# EAGLE design CAN Interface (EAGLE 7.2.0)
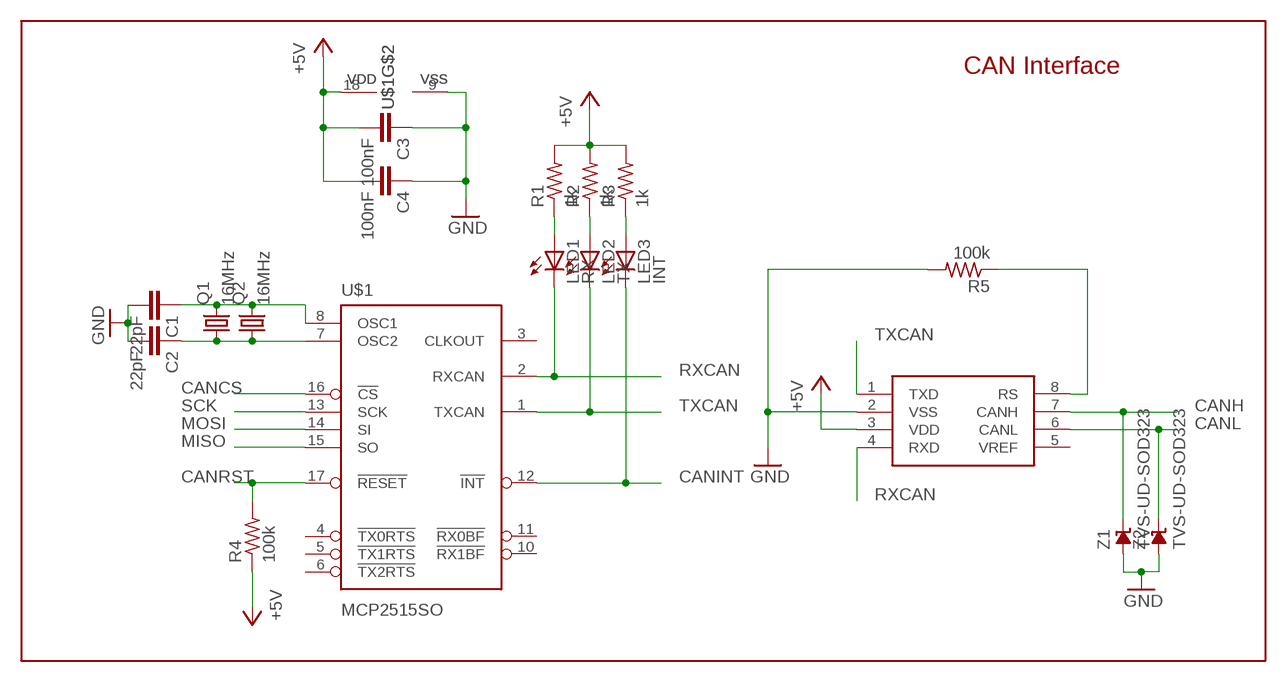
[diagram p0: schematic, sheet 1]

## Parts
C1  22pF  C-EUC0805K  [C0805K]
C2  22pF  C-EUC0805K  [C0805K]
C3  100nF  C-EUC0805K  [C0805K]
C4  100nF  C-EUC0805K  [C0805K]
LED1  RX  LEDCHIP-LED0805  [CHIP-LED0805]
LED2  TX  LEDCHIP-LED0805  [CHIP-LED0805]
LED3  INT  LEDCHIP-LED0805  [CHIP-LED0805]
Q1  16MHz  CRYSTALHC49S  [HC49/S]
Q2  16MHz  CRYSTALHC49UP  [HC49UP]
R1  1k  R-US_R0805  [R0805]
R2  1k  R-US_R0805  [R0805]
R3  1k  R-US_R0805  [R0805]
R4  100k  R-US_R0805  [R0805]
R5  100k  R-US_R0805  [R0805]
U1  MCP2551  [SO08]
U$1  MCP2515SO  [SO-18W]
Z1  TVS-UD-SOD323  [SOD323]
Z2  TVS-UD-SOD323  [SOD323]

## Nets
+5V: C3.2 C4.2 R1.2 R2.2 R3.2 R4.1 U1.3(VDD) U$1.18(VDD)
CANCS: U$1.16(!CS)
CANH: U1.7(CANH) Z1.C
CANINT: LED3.C U$1.12(!INT)
CANL: U1.6(CANL) Z2.C
CANRST: R4.2 U$1.17(!RESET)
CANSTBY: R5.1 U1.8(RS)
GND: C1.2 C2.2 C3.1 C4.1 R5.2 U1.2(VSS) U$1.9(VSS) Z1.A Z2.A
MISO: U$1.15(SO)
MOSI: U$1.14(SI)
N$1: C2.1 Q1.1 Q2.1 U$1.7(OSC2)
N$4: C1.1 Q1.2 Q2.2 U$1.8(OSC1)
N$7: LED1.A R1.1
N$8: LED2.A R2.1
N$9: LED3.A R3.1
RXCAN: LED1.C U1.4(RXD) U$1.2(RXCAN)
SCK: U$1.13(SCK)
TXCAN: LED2.C U1.1(TXD) U$1.1(TXCAN)
Unconnected: U1.5(VREF) U$1.3(CLKOUT) U$1.4(!TX0RTS) U$1.5(!TX1RTS) U$1.6(!TX2RTS) U$1.10(!RX1BF) U$1.11(!RX0BF)

## Notes on the sheet
- CAN Interface

## Library data of the parts
C1-C4 = resistor:C-EU: CAPACITOR, European symbol
LED1-LED3 = led:LED: LED OSRAM: - CHIPLED LG R971, LG N971, LY N971, LG Q971, LY Q971, LO R971, LY R971 LH N974, LH R974 LS Q976, LO Q976, LY Q976 LO Q996 - Hyper CHIPLED LW Q18S LB Q993, LB Q99A, LB R99A - SideLED LS A670, LO A670, LY A670, LG A670, LP A670 LB A673, LV A673, LT A673, LW A673 LH A674 LY A675 LS A676, LA A676, LO A676, LY A676, LW A676 LS A679, LY A679, LG A679 - Hyper Micro SIDELED® LS Y876, LA Y876, LO Y876, LY Y876 LT Y87S - SmartLED LW L88C, LW L88S LB L89C, LB L89S, LG L890 LS L89K, LO L89K, LY L89K LS L896, LA L896, LO L896, LY L896 - TOPLED LS T670, LO T670, LY T670, LG T670, LP T670 LSG T670, LSP T670, LSY T670, LOP T670, LYG T670 LG T671, LOG T671, LSG T671 LB T673, LV T673, LT T673, LW T673 LH T674 LS T676, LA T676, LO T676, LY T676, LB T676, LH T676, LSB T676, LW T676 LB T67C, LV T67C, LT T67C, LS T67K, LO T67K, LY T67K, LW E67C LS E67B, LA E67B, LO E67B, LY E67B, LB E67C, LV E67C, LT E67C LW T67C LS T679, LY T679, LG T679 LS T770, LO T770, LY T770, LG T770, LP T770 LB T773, LV T773, LT T773, LW T773 LH T774 LS E675, LA E675, LY E675, LS T675 LS T776, LA T776, LO T776, LY T776, LB T776 LHGB T686 LT T68C, LB T68C - Hyper Mini TOPLED® LB M676 - Mini TOPLED Santana® LG M470 LS M47K, LO M47K, LY M47K Source: http://www.osram.convergy.de LUXEON: - LUMILED® LXK2-PW12-R00, LXK2-PW12-S00, LXK2-PW14-U00, LXK2-PW14-V00 LXK2-PM12-R00, LXK2-PM12-S00, LXK2-PM14-U00 LXK2-PE12-Q00, LXK2-PE12-R00, LXK2-PE12-S00, LXK2-PE14-T00, LXK2-PE14-U00 LXK2-PB12-K00, LXK2-PB12-L00, LXK2-PB12-M00, LXK2-PB14-N00, LXK2-PB14-P00, LXK2-PB14-Q00 LXK2-PR12-L00, LXK2-PR12-M00, LXK2-PR14-Q00, LXK2-PR14-R00 LXK2-PD12-Q00, LXK2-PD12-R00, LXK2-PD12-S00 LXK2-PH12-R00, LXK2-PH12-S00 LXK2-PL12-P00, LXK2-PL12-Q00, LXK2-PL12-R00 Source: www.luxeon.com KINGBRIGHT: KA-3528ASYC Source: www.kingbright.com
Q1 = crystal:CRYSTAL: CRYSTAL; OC_FARNELL: 1667008; OC_NEWARK: unknown
Q2 = crystal:CRYSTAL: CRYSTAL; OC_FARNELL: unknown; OC_NEWARK: unknown
R1-R5 = resistor:R-US_: RESISTOR, American symbol
U1 = SparkFun:MCP2551
U$1 = RobThePyro:MCP2515: MCP2515 CAN Controller by Microchip
Z1 Z2 = supressor:TVS-UD-: TVS UNI-DIRECTIONAL

## Board
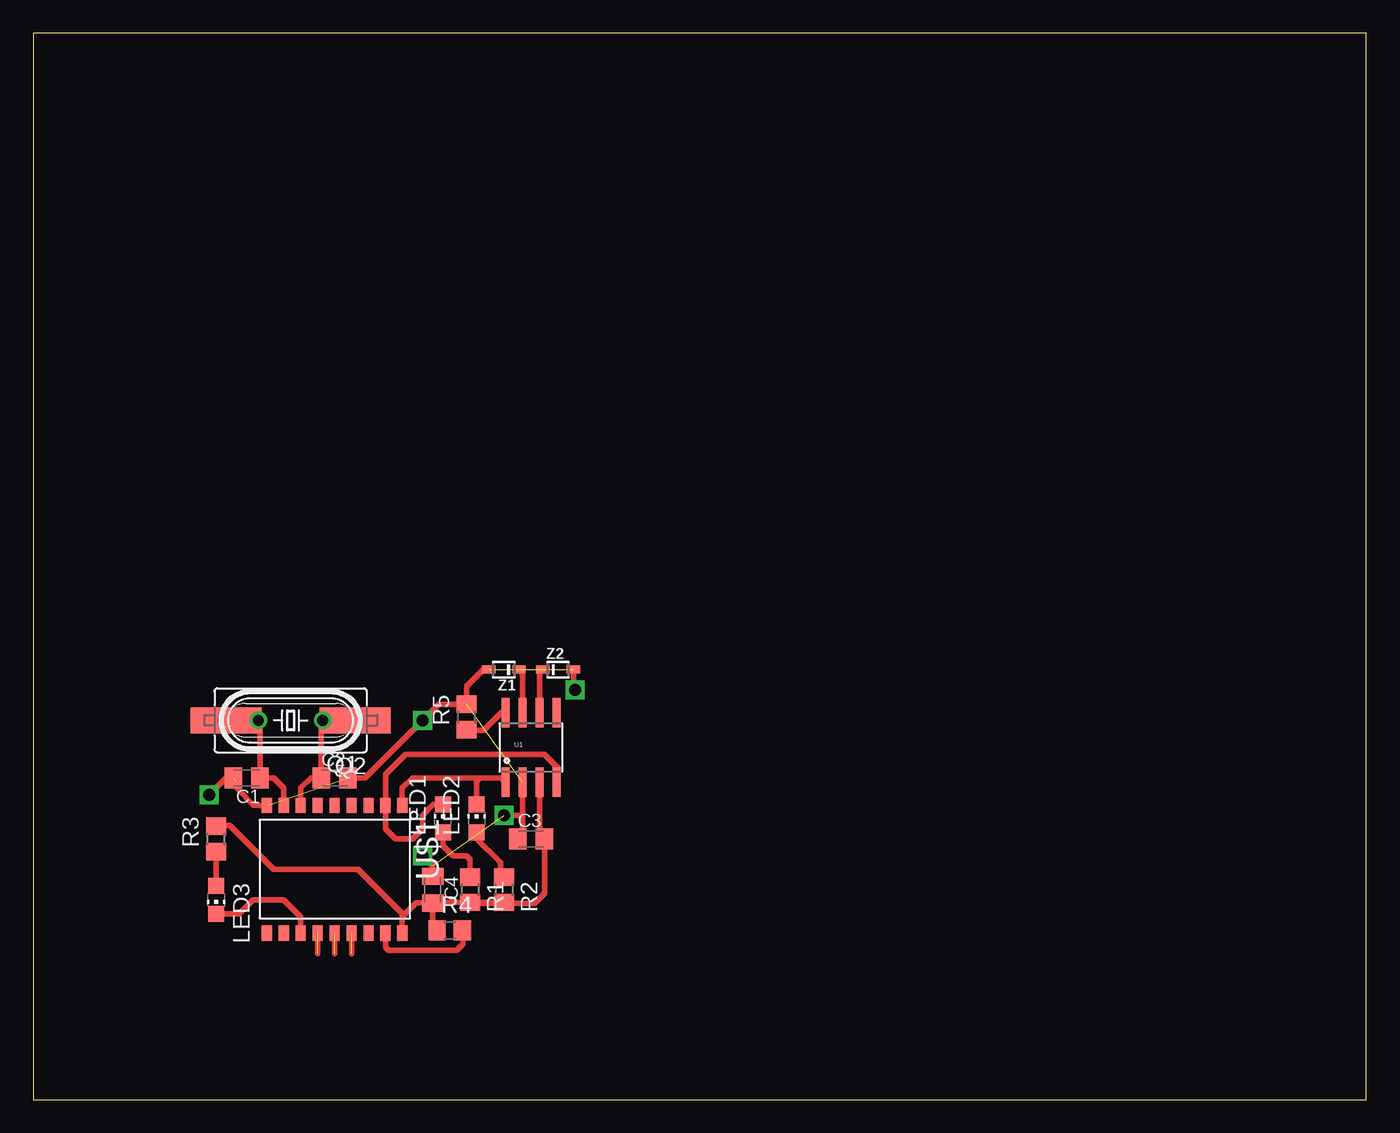
[diagram p1: board, top side]

Size 100 x 80 mm. Coordinates in mm from the lower left corner, seen from the top.
Outline: 0,0 100,0 100,80 0,80 0,0
Copper layers (1*16): Top 0.035mm / dielectric 1.5mm / Bottom 0.035mm
Design rules "default": minimum track width 10mil, minimum drill 24mil, track to track 8mil, track to pad 8mil, pad to pad 8mil, via to via 8mil, smd to smd 8mil, copper to edge 40mil, drill to drill 8mil, minimum pad ring 10mil, minimum via ring 8mil, stop-mask expansion 4mil, vias tented up to drill 0mil, thermal gap 10mil

### Footprints (pad centres in the part's own frame; a part is rotated, then mirrored left to right if it is on the bottom)
C0805K = smd 1.3 x 1.6: 1 -1,0; 2 1,0
CHIP-LED0805 = smd 1.2 x 1.2: A 0,-1.05; C 0,1.05
HC49/S = drill 0.813: 1 -2.413,0; 2 2.413,0
HC49UP = smd 5.334 x 1.93: 1 -4.826,0; 2 4.826,0
R0805 = smd 1.3 x 1.5: 1 -0.95,0; 2 0.95,0
SO08 = smd 0.61 x 2.21: 1 -1.905,-2.616; 2 -0.635,-2.616; 3 0.635,-2.616; 4 1.905,-2.616; 5 1.905,2.616; 6 0.635,2.616; 7 -0.635,2.616; 8 -1.905,2.616
SO-18W = smd 0.762 x 1.143: 1 -5.08,-4.788; 2 -3.81,-4.788; 3 -2.54,-4.788; 4 -1.27,-4.788; 5 0,-4.788; 6 1.27,-4.788; 7 2.54,-4.788; 8 3.81,-4.788; 9 5.08,-4.788; 10 5.08,4.788; 11 3.81,4.788; 12 2.54,4.788; 13 1.27,4.788; 14 0,4.788; 15 -1.27,4.788; 16 -2.54,4.788; 17 -3.81,4.788; 18 -5.08,4.788
SOD323 = smd 1 x 0.6: A 1.143,0; C -1.143,0

### Placement (x,y rotation side)
C1  16,24.13 180 top
C2  22.61,24.13 0 top
C3  37.34,19.56 0 top
C4  29.97,15.75 270 top
LED1  30.73,21.08 0 top
LED2  33.27,21.08 0 top
LED3  13.72,14.99 180 top
Q1  19.3,28.45 180 top
Q2  19.3,28.45 180 top
R1  32.77,15.75 270 top
R2  35.31,15.75 270 top
R3  13.72,19.56 90 top
R4  31.24,12.7 0 top
R5  32.51,28.7 90 top
U1  37.34,26.42 0 top
U$1  22.61,17.27 180 top
Z1  35.31,32.26 180 top
Z2  39.37,32.26 0 top

### Tracks (layer width: path | path; a pad name or v marks a point on that pad's centre or on a via)
+5V
  Top 0.406: U1.3 37.97,19.92 C3.2 38.34,15.48 37.59,14.73 33.34,14.73 R2.2 R1.2 30.02,14.8 C4.2 | 27.69,13.72 27.69,13.97 24.38,17.27 18.03,17.27 14.73,20.57 13.78,20.57 R3.2 | 27.69,13.72 U$1.18 | C4.2 28.72,14.75 27.69,13.72 | C4.2 29.97,13.02 R4.1
CANH
  Top 0.406: U1.7 36.7,32 Z1.C
CANINT
  Top 0.406: LED3.C 15.46,13.94 16.51,14.99 18.8,14.99 20.07,13.72 U$1.12
CANL
  Top 0.406: U1.6 37.97,32 Z2.C
CANRST
  Top 0.406: U$1.17 26.42,11.43 26.67,11.18 31.75,11.18 32.26,11.68 32.26,12.63 R4.2
CANSTBY
  Top 0.406: U1.8 35.13,29.03 33.78,27.69 32.58,27.69 R5.1
GND  (via drill 0.9 pad 1.42)  (5 unrouted)
  Top 0.406: U1.2 36.7,21.34 | 36.7,21.34 36.7,19.92 C3.1 | U$1.9 16.55,22.06 15.24,23.37 15.24,23.89 | Z1.A 33.78,32.26 32.51,30.99 R5.2 30.41,29.65 v29.21,28.45 24.89,24.13 C2.2 | C4.1 29.97,17.53 v29.21,18.29 | v35.31,21.34 36.7,21.34 | Z2.A 40.51,30.86 v40.64,30.73 | C1.2 14.48,24.13 v13.21,22.86
MISO  (1 unrouted)
  Top 0.406: U$1.15 23.88,10.92
MOSI  (1 unrouted)
  Top 0.406: U$1.14 22.61,10.92
N$1
  Top 0.406: Q2.1 Q1.1 21.61,28.45 C2.1 20.83,24.13 20.07,23.37 U$1.7
N$4
  Top 0.406: Q2.2 Q1.2 17,28.45 C1.1 18.03,24.13 18.8,23.37 U$1.8
N$7
  Top 0.406: LED1.A 30.73,19.05 31.5,18.29 32.51,18.29 32.77,18.03 R1.1
N$8
  Top 0.406: LED2.A 33.27,19.56 35.05,17.78 35.05,16.95 R2.1
N$9
  Top 0.406: LED3.A R3.1
RXCAN
  Top 0.406: LED1.C 30.01,22.13 29.21,21.34 29.21,20.32 28.45,19.56 27.18,19.56 26.42,20.32 U$1.2 26.42,24.38 27.94,25.91 38.35,25.91 39.37,24.89 39.37,23.93 U1.4
SCK  (1 unrouted)
  Top 0.406: U$1.13 21.34,10.92
TXCAN
  Top 0.406: U$1.1 27.69,23.37 28.45,24.13 33.53,24.13 | 33.53,24.13 35.1,24.13 U1.1 | LED2.C 33.27,23.88 33.53,24.13